# EAGLE design RF EtherCard Maniac (EAGLE 6.1)
ABBREV: ec1; PROJECT: Ethernet Card
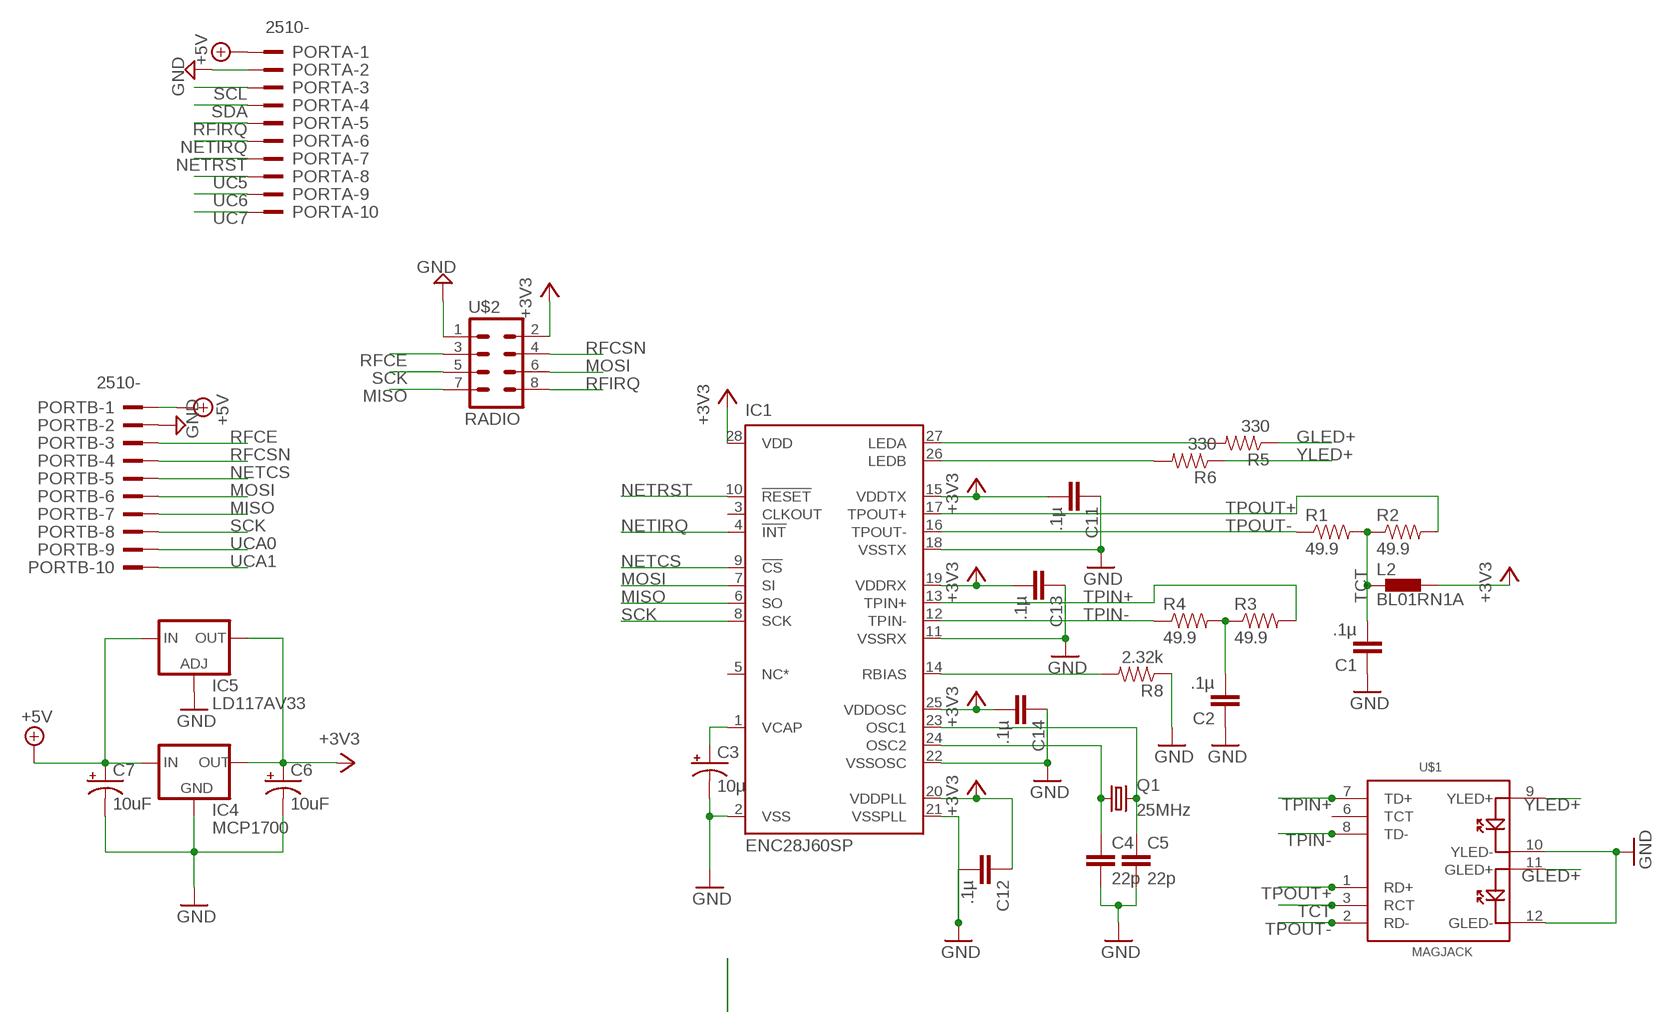
[diagram p0: schematic, sheet 1]

## Parts
C1  .1µ  CAPPTH  [CAP-PTH-SMALL]
C2  .1µ  CAPPTH  [CAP-PTH-SMALL]
C3  10µ  CAP_POLPTH2  [CPOL-RADIAL-10UF-25V]
C4  22p  CAPPTH  [CAP-PTH-SMALL]
C5  22p  CAPPTH  [CAP-PTH-SMALL]
C6  10uF  CAP_POLPTH2  [CPOL-RADIAL-10UF-25V]
C7  10uF  CAP_POLPTH2  [CPOL-RADIAL-10UF-25V]
C11  .1µ  CAPPTH  [CAP-PTH-SMALL]
C12  .1µ  CAPPTH  [CAP-PTH-SMALL]
C13  .1µ  CAPPTH  [CAP-PTH-SMALL]
C14  .1µ  CAPPTH  [CAP-PTH-SMALL]
IC1  ENC28J60SP  [DIL28-3]
IC4  MCP1700  [TO92A]
IC5  LD117AV33  [TO220L1]
L2  BL01RN1A  [BL01RN1A]
PORTA  2510-  [PAK100/2500-10]
PORTB  2510-  [PAK100/2500-10]
Q1  25MHz  CRYSTALHC49US  [HC49US]
R1  49.9  RESISTORPTH1  [AXIAL-0.3]
R2  49.9  RESISTORPTH1  [AXIAL-0.3]
R3  49.9  RESISTORPTH1  [AXIAL-0.3]
R4  49.9  RESISTORPTH1  [AXIAL-0.3]
R5  330  RESISTORPTH1  [AXIAL-0.3]
R6  330  RESISTORPTH1  [AXIAL-0.3]
R8  2.32k  RESISTORPTH1  [AXIAL-0.3]
U$1  MAGJACK  [MAGJACK]
U$2  RADIO  M04X2  [2X4]

## Nets
+3V3 [power]: C6.1(+) C11.2 C12.1 C13.2 C14.2 IC1.15(VDDTX) IC1.19(VDDRX) IC1.20(VDDPLL) IC1.25(VDDOSC) IC1.28(VDD) IC4.3(OUT) IC5.2(OUT) L2.2 U$2.2
+5V [power]: C7.1(+) IC4.2(IN) IC5.3(IN) PORTA.1 PORTB.1
GLED+: R5.P$1 U$1.11(GLED+)
GND [power]: C1.1 C2.1 C3.2(-) C4.2 C5.2 C6.2(-) C7.2(-) C11.1 C12.2 C13.1 C14.1 IC1.2(VSS) IC1.11(VSSRX) IC1.18(VSSTX) IC1.21(VSSPLL) IC1.22(VSSOSC) IC4.1(GND) IC5.1(ADJ) PORTA.2 PORTB.2 R8.P$1 U$1.10(YLED-) U$1.12(GLED-) U$2.1
LEDA: IC1.27(LEDA) R5.P$2
LEDB: IC1.26(LEDB) R6.P$2
MISO: IC1.6(SO) PORTB.7 U$2.7
MOSI: IC1.7(SI) PORTB.6 U$2.6
N$3: IC1.14(RBIAS) R8.P$2
N$4 [power]: C4.1 IC1.24(OSC2) Q1.1
N$5 [power]: C5.1 IC1.23(OSC1) Q1.2
NETCS: IC1.9(!CS) PORTB.5
NETIRQ: IC1.4(!INT) PORTA.6
NETRST: IC1.10(!RESET) PORTA.7
RFCE: PORTB.3 U$2.3
RFCSN: PORTB.4 U$2.4
RFIRQ: PORTA.5 U$2.8
SCK: IC1.8(SCK) PORTB.8 U$2.5
SCL: PORTA.3
SDA: PORTA.4
TCT [power]: C1.2 L2.1 R1.P$2 R2.P$1 U$1.3(RCT)
TPGND [power]: C2.2 R3.P$1 R4.P$2
TPIN+ [power]: IC1.13(TPIN+) R3.P$2 U$1.7(TD+)
TPIN- [power]: IC1.12(TPIN-) R4.P$1 U$1.8(TD-)
TPOUT+ [power]: IC1.17(TPOUT+) R2.P$2 U$1.1(RD+)
TPOUT- [power]: IC1.16(TPOUT-) R1.P$1 U$1.2(RD-)
UC5: PORTA.8
UC6: PORTA.9
UC7: PORTA.10
UCA0: PORTB.9
UCA1: PORTB.10
VCAP [power]: C3.1(+) IC1.1(VCAP)
YLED+: R6.P$1 U$1.9(YLED+)
Unconnected: IC1.3(CLKOUT) IC1.5(NC*) U$1.6(TCT)

## Library data of the parts
C1 C2 C4 C5 C11-C14 = SparkFun:CAP: Capacitor Standard 0603 ceramic capacitor, and 0.1" leaded capacitor.
C3 C6 C7 = SparkFun:CAP_POL: Capacitor Polarized These are standard SMD and PTH capacitors. Normally 10uF, 47uF, and 100uF in electrolytic and tantalum varieties. Always verify the external diameter of the through hole cap, it varies with capacity, voltage, and manufacturer. The EIA devices should be standard.
IC1 = microchip:ENC28J60: Stand-Alone Ethernet Controller with SPI Interface Source: http://ww1.microchip.com/downloads/en/DeviceDoc/39662c.pdf
IC4 = JC:MCP1700: VOLTAGE REGULATOR
IC5 = v-reg:LD117A?*: Low drop fixed and adjustable positive voltage regulators 1 A Source: http://www.st.com/stonline/products/literature/ds/7194/ld1117axx.pdf
L2 = inductors:BL0: Noise Suppression Products/EMI Suppression Filters, Lead EMIFIL(R) Inductor Type Source: http://www.murata.com .. BL01RN1_DS.pdf
PORTA PORTB = con-3m:2510-: 3M (TM) Pak 100 4-Wall Header Source: 3M; MF: 3M; MPN: 2510-6002UB; OC_FARNELL: 9838244; OC_NEWARK: 46F4725
Q1 = SparkFun:CRYSTAL: Crystals Various standard crystals. Proven footprints. Spark Fun Electronics SKU : COM-00534
R1-R6 R8 = SparkFun:RESISTOR: Resistor Basic schematic elements and footprints for 0603, 1206, and PTH 1/10th watt (small) resistors.
U$1 = SparkFun:MAGJACK
U$2 = SparkFun:M04X2

## Net classes
0 default: width 0.229 mm, clearance 0.178 mm
1 power: width 0.406 mm, clearance 0.254 mm

## Board
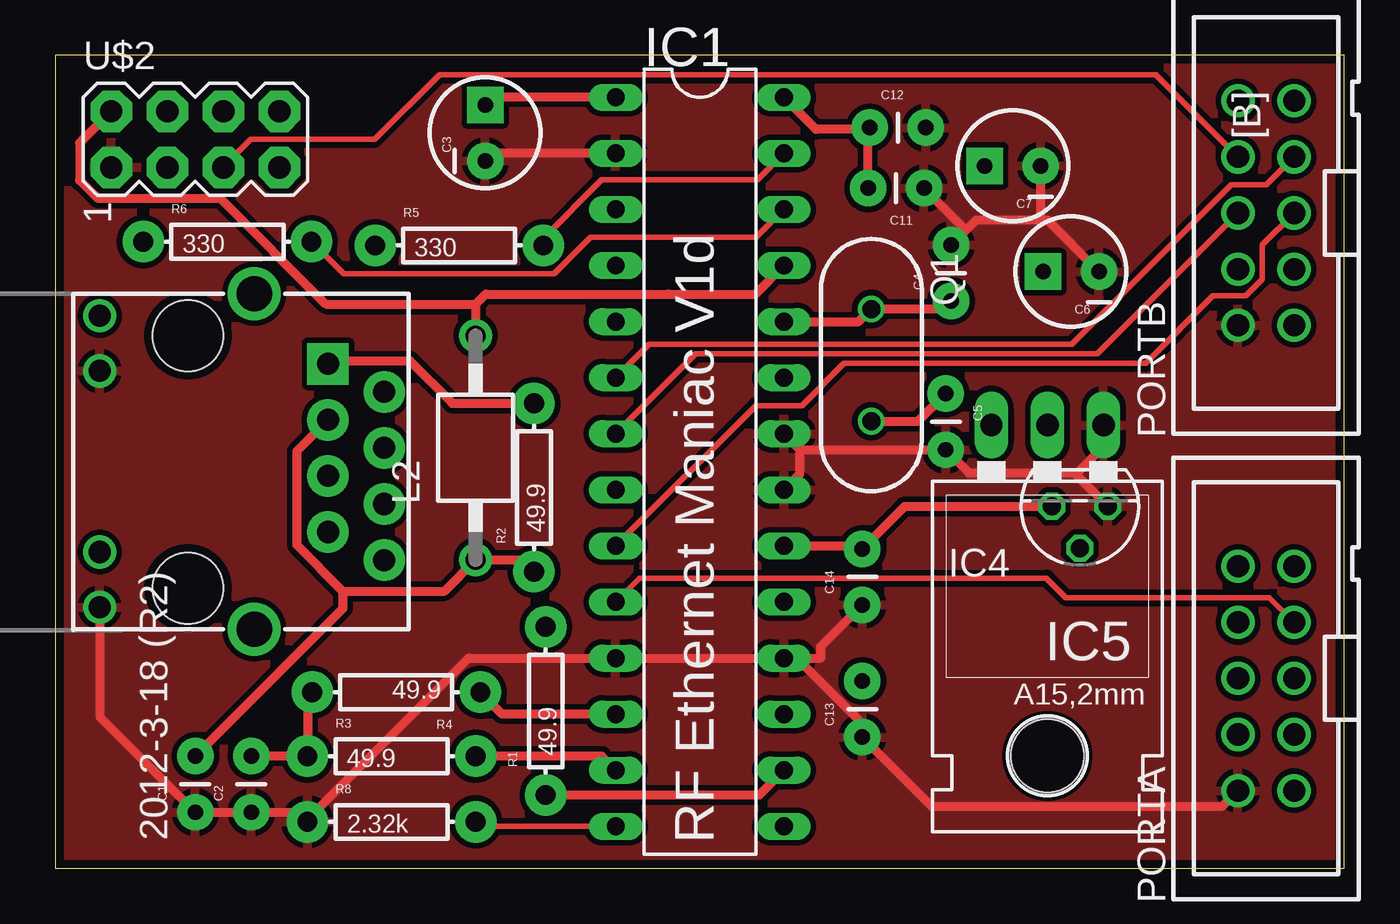
[diagram p1: board, top side]
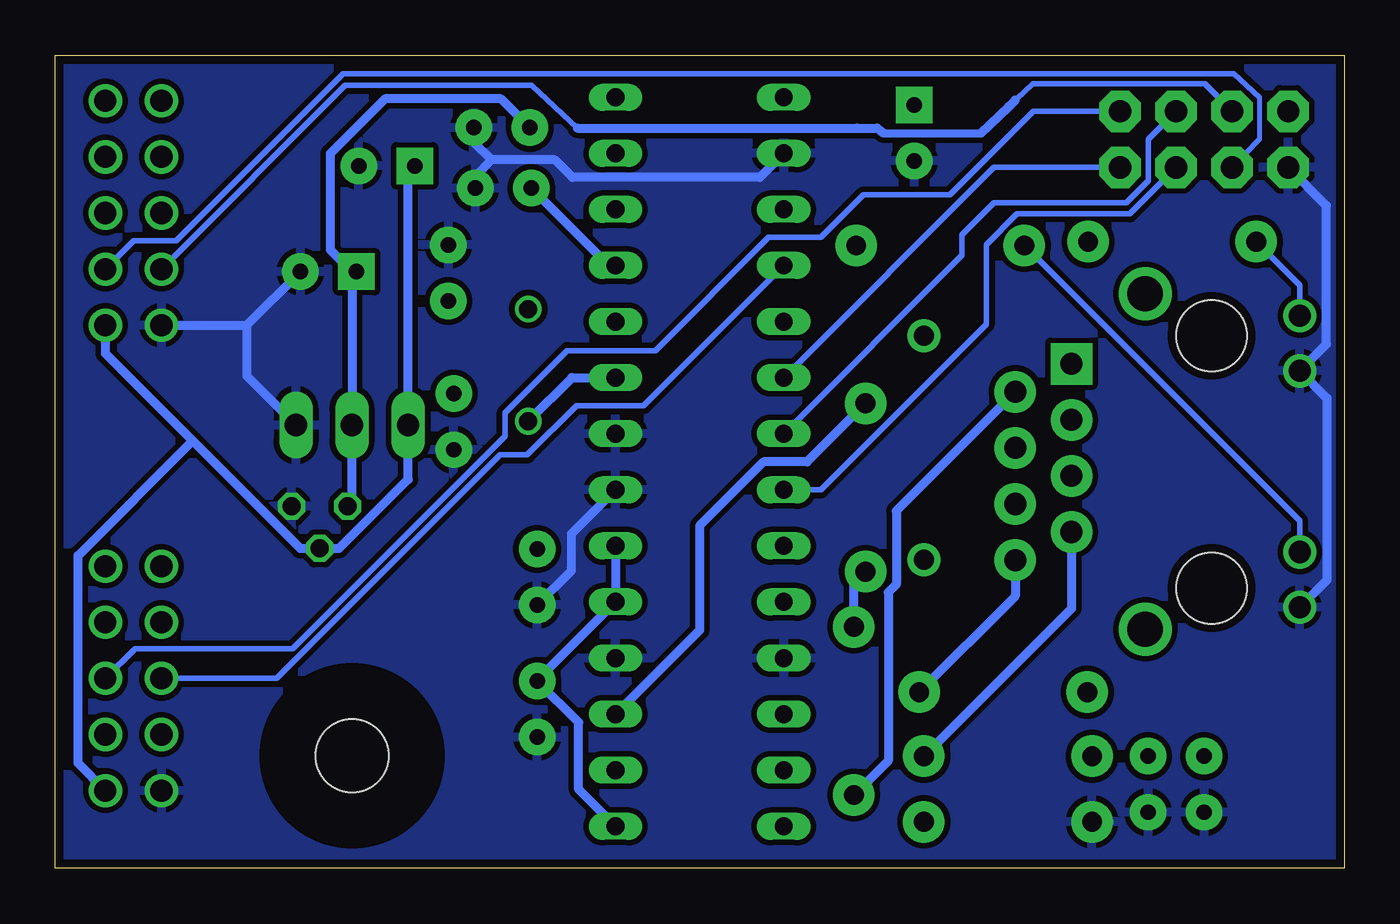
[diagram p2: board, bottom side, seen from below]

Size 58.41 x 36.83 mm. Coordinates in mm from the lower left corner, seen from the top.
Outline: 0,36.83 0,0 58.41,0 58.41,36.83 0,36.83
Copper layers (1*16): Top 0.0356mm / dielectric 1.5011mm / Bottom 0.0356mm
Design rules: minimum track width 6mil, minimum drill 13mil, track to track 6mil, track to pad 6mil, pad to pad 6mil, via to via 6mil, smd to smd 6mil, copper to edge 15mil, drill to drill 6mil, minimum pad ring 7mil, minimum via ring 7mil, stop-mask expansion 4mil, vias tented up to drill 25mil, thermal gap 10mil

### Footprints (pad centres in the part's own frame; a part is rotated, then mirrored left to right if it is on the bottom)
CAP-PTH-SMALL = drill 0.7 pad 1.651: 1 0,0; 2 2.54,0
CPOL-RADIAL-10UF-25V = drill 0.7 pad 1.651 square: 1 1.27,0 | drill 0.7 pad 1.651: 2 -1.27,0
DIL28-3 = drill 0.813 long: 1 -16.51,-3.81; 2 -13.97,-3.81; 3 -11.43,-3.81; 4 -8.89,-3.81; 5 -6.35,-3.81; 6 -3.81,-3.81; 7 -1.27,-3.81; 8 1.27,-3.81; 9 3.81,-3.81; 10 6.35,-3.81; 11 8.89,-3.81; 12 11.43,-3.81; 13 13.97,-3.81; 14 16.51,-3.81; 15 16.51,3.81; 16 13.97,3.81; 17 11.43,3.81; 18 8.89,3.81; 19 6.35,3.81; 20 3.81,3.81; 21 1.27,3.81; 22 -1.27,3.81; 23 -3.81,3.81; 24 -6.35,3.81; 25 -8.89,3.81; 26 -11.43,3.81; 27 -13.97,3.81; 28 -16.51,3.81
TO92A = drill 0.813 octagon: 1 -1.27,0; 2 0,1.905; 3 1.27,0
TO220L1 = drill 1.016 long: 1 -2.54,-3.81; 2 0,-3.81; 3 2.54,-3.81 | hole 3.302: 0,11.176
BL01RN1A = drill 0.9 pad 1.5: 1 -5.08,0; 2 5.08,0
PAK100/2500-10 = drill 1 pad 1.422: 1 -5.08,-1.27; 2 -5.08,1.27; 3 -2.54,-1.27; 4 -2.54,1.27; 5 0,-1.27; 6 0,1.27; 7 2.54,-1.27; 8 2.54,1.27; 9 5.08,-1.27; 10 5.08,1.27
HC49US = drill 0.813: 1 -2.54,0; 2 2.54,0
AXIAL-0.3 = drill 0.9 pad 1.88: P$1 -3.81,0; P$2 3.81,0
MAGJACK = drill 1 pad 1.88 square: 1 3.175,17.445 | drill 1 pad 1.88: 2 4.445,19.985; 3 5.715,17.445; 4 6.985,19.985; 5 8.255,17.445; 6 9.525,19.985; 7 10.795,17.445; 8 12.065,19.985 | drill 1 pad 1.27: 9 1,7.1; 10 3.5,7.1; 11 11.7,7.1; 12 14.2,7.1 | drill 1.6 pad 2.184: M1 0,14.1; M2 15.2,14.1 | hole 3.2: 1.905,11.095; 13.335,11.095
2X4 = drill 1.016 pad 1.88 octagon: 1 -3.81,-1.27; 2 -3.81,1.27; 3 -1.27,-1.27; 4 -1.27,1.27; 5 1.27,-1.27; 6 1.27,1.27; 7 3.81,-1.27; 8 3.81,1.27

### Placement (x,y rotation side)
C1  6.35,2.54 90 top
C2  8.89,2.54 90 top
C3  19.49,33.31 90 top
C4  40.59,25.69 90 top
C5  40.35,21.5 270 top
C6  46.03,27.03 180 top
C7  43.39,31.82 180 top
C11  39.37,30.81 180 top
C12  36.9,33.55 0 top
C13  36.57,5.94 90 top
C14  36.57,11.93 90 top
IC1  29.21,18.41 270 top
IC4  46.43,16.4 180 top
IC5  44.96,16.27 180 top
L2  19.05,19.05 90 top
PORTA  54.86,8.6 90 top
PORTB  54.86,29.68 90 top
Q1  36.97,22.79 270 top
R1  22.23,7.13 90 top
R2  21.7,17.25 90 top
R3  15.24,5.08 0 top
R4  15.45,7.98 180 top
R5  18.31,28.21 0 top
R6  7.8,28.38 0 top
R8  15.24,2.11 0 top
U$1  -5.08,26.03 270 top
U$2  6.35,33.02 0 top

### Tracks (layer width: path | path; a pad name or v marks a point on that pad's centre or on a via)
+3V3
  Top 0.406: IC1.25 31.73,26.01 27.8,26.01 19.51,26.01 19.05,25.56 | U$2.2 1.11,32.86 1.11,31.16 1.92,30.35 7.47,30.35 12.26,25.56 19.05,25.56 | 19.05,25.56 L2.2 | 36.83,33.47 C12.1 | C11.2 36.83,33.47 | 36.83,33.47 34.47,33.47 IC1.28 | IC4.3 38.5,16.4 C14.2 36.44,14.61 IC1.20
  Bottom 0.406: C12.1 38.21,34.85 43.46,34.85 45.95,32.37 45.95,28.02 44.96,27.03 | 44.96,27.03 IC5.2 44.96,16.59 IC4.3 | 44.96,27.03 C6.1 | IC1.20 IC1.19 36.57,8.51 C13.2 34.7,6.61 34.7,3.58 IC1.15 | IC1.25 33.33,27.3 C11.2
+5V
  Bottom 0.406: C7.1 42.42,31.52 IC5.3 42.42,17.62 45.54,14.49 IC4.2 47.31,14.49 52.18,19.36 | PORTB.1 56.13,23.32 52.18,19.36 | PORTA.1 57.37,4.76 57.37,14.16 52.18,19.36
GLED+
  Bottom 0.254: U$1.11 2.02,15.73 R5.P$1
GND
  Top 0.406: 11.38,2.16 18.74,9.53 IC1.11 IC1.18 33.6,9.53 | 41.27,28.91 41.73,29.38 44.66,29.38 | C4.2 41.27,28.91 | 41.27,28.91 C11.1 | 44.66,29.38 44.95,29.38 C6.2 | 44.66,29.38 C7.2 | 46.31,17.91 47.5,19.1 IC5.1 | IC4.1 46.31,17.78 46.31,17.91 | 46.31,17.91 41.39,17.91 C5.2 33.74,18.96 | IC1.22 33.74,18.96 | IC1.21 33.74,17.87 33.74,18.96 | 33.6,9.53 36.57,6.55 C13.1 39.7,2.81 52.89,2.81 PORTA.2 | 33.6,9.53 34.7,9.53 34.7,10.05 C14.1 | 11.38,2.16 R8.P$1 | 11.38,2.16 11,2.54 C2.1 C1.1 2.02,6.87 U$1.12 | IC1.2 19.83,32.38 C3.2
  Bottom 0.406: C14.1 35.02,13.49 35.02,15.15 IC1.21 | U$2.1 0.81,30.02 0.81,23.74 U$1.10 0.79,21.3 0.79,13.06 U$1.12 | 49.73,24.6 C6.2 | 49.73,24.6 49.73,22.31 IC5.1 | PORTB.2 49.73,24.6 | 38.64,32.09 39.45,32.9 C12.2 | 38.64,32.09 39.37,31.36 C11.1 | IC1.2 26.49,31.3 34.97,31.3 35.76,32.09 38.64,32.09
  pour Bottom: 0.13,36.86 0.13,0.36 58.55,0.36 58.55,37.03 58.24,37.03
  pour Top: -1.09,37.57 -1.09,-0.79 59.39,-0.79 59.39,37.74 59.21,37.74
LEDA
  Top 0.254: IC1.27 31.82,31.19 24.76,31.19 22.12,28.55 R5.P$2
LEDB
  Top 0.254: R6.P$2 13.06,26.93 22.61,26.93 24.25,28.57 31.75,28.57 IC1.26
MISO
  Top 0.254: IC1.6 26.91,23.74 46.07,23.74 53.28,30.95 54.86,30.95 PORTB.7
  Bottom 0.254: IC1.6 15.88,31.75 U$2.7
MOSI
  Top 0.254: IC1.7 29.02,23.31 47.22,23.31 PORTB.6
  Bottom 0.254: IC1.7 17.32,27.76 17.32,28.7 15.87,30.15 9.89,30.15 8.89,31.15 8.89,33.02 U$2.6
N$3
  Top 0.254: R8.P$2 19.25,1.91 IC1.14
N$4
  Top 0.406: IC1.24 36.41,24.77 Q1.1 40.23,25.33 C4.1
N$5
  Top 0.406: Q1.2 39.1,20.25 C5.1
  Bottom 0.406: Q1.2 35,22.23 IC1.23
NETCS
  Top 0.254: IC1.9 31.75,20.95 33.83,20.95 35.75,22.88 49.41,22.88 52.46,25.93 53.94,25.93 54.69,26.68 54.69,28.23 PORTB.5
NETIRQ
  Bottom 0.254: PORTA.6 48.38,8.6 38.26,18.73 37.02,18.73 34.8,20.95 31.75,20.95 IC1.4
NETRST
  Top 0.254: IC1.10 26.48,13.14 44.92,13.14 45.8,12.26 55.02,12.26 PORTA.7
RFCE
  Bottom 0.229: 3.85,34.92 3.85,33.02
  Bottom 0.254: PORTB.3 54.84,28.43 52.92,28.43 45.36,35.99 5,35.99 3.85,34.92 | 3.85,33.02 U$2.3
RFCSN
  Bottom 0.254: 16.25,33.53 15.21,34.51 | 15.21,34.51 14.1,35.54 6.33,35.54 U$2.4 | PORTB.4 45.27,35.47 36.83,35.47 34.75,33.53 | 15.21,34.51 15.24,34.54 15.2,34.51
  Bottom 0.356: 20.88,33.3 16.46,33.3
  Bottom 0.406: 34.75,33.53 22.07,33.53 21.16,33.53 20.88,33.3 | 16.46,33.3 15.2,34.51 14.91,34.8
RFIRQ
  Bottom 0.254: PORTA.5 54.78,9.95 47.65,9.95 38.02,19.57 38.02,20.64 35.22,23.45 31.22,23.45 26.09,28.57 23.72,28.57 21.79,30.51 17.86,30.51 14.08,34.29 U$2.8
SCK
  Top 0.254: U$2.5 8.87,33.02 14.46,33.02 17.42,35.95 49.87,35.95 PORTB.8
  Bottom 0.254: U$2.5 9.73,29.64 14.83,29.64 16.23,28.25 16.23,24.64 23.72,17.14 IC1.8
TCT
  Top 0.406: U$1.3 10.94,18.89 10.94,14.65 13.03,12.56 | 13.03,12.56 13.03,11.76 C1.2 | 13.03,12.56 17.64,12.56 L2.1 21.17,13.97 R2.P$1
  Bottom 0.406: R1.P$2 22.23,12.91 R2.P$1
TPGND
  Top 0.406: C2.2 R3.P$1 11.43,7.76 R4.P$2
TPIN+
  Top 0.406: IC1.13 24.77,5.08 R3.P$2
  Bottom 0.406: U$1.7 12.37,11.77 R3.P$2
TPIN-
  Top 0.406: IC1.12 20.25,6.99 R4.P$1
  Bottom 0.406: U$1.8 14.9,12.34 R4.P$1
TPOUT+
  Top 0.406: U$1.1 12.51,23 16.06,23 18,21.06 R2.P$2
  Bottom 0.406: R2.P$2 24.34,18.41 26.31,18.41 29.21,15.51 29.21,10.79 IC1.17
TPOUT-
  Top 0.406: IC1.16 31.89,3.32 R1.P$1
  Bottom 0.406: U$1.2 20.3,16.19 20.3,12.86 20.66,12.5 20.66,4.88 R1.P$1
VCAP
  Top 0.406: IC1.1 19.83,34.92 C3.1
YLED+
  Bottom 0.254: U$1.9 2.02,26.41 R6.P$1

### Text on the board
tPlace: [B] | 1 | 2012-3-18 (R2) | RF Ethernet Maniac V1d